# Altium project Rover_Alim.PrjPcb
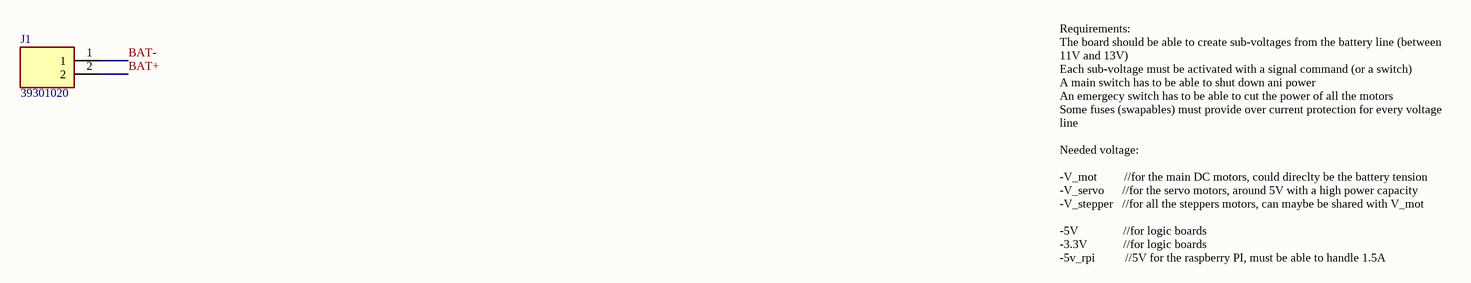
[diagram p0: Rover_Alim.SchDoc]
1 sheet, 1 parts. Net scope: global (net labels, ports and power ports of the same name join across sheets).

## Sheet Rover_Alim.SchDoc
size A4

### Parts
J1  39301020  [39301020]

### Nets
BAT+: J1.2
BAT-: J1.1

### Notes on the sheet
- Requirements:
  The board should be able to create sub-voltages from the battery line (between 11V and 13V)
  Each sub-voltage must be activated with a signal command (or a switch)
  A main switch has to be able to shut down ani power
  An emergecy switch has to be able to cut the power of all the motors
  Some fuses (swapables) must provide over current protection for every voltage line
  Needed voltage:
  -V_mot         //for the main DC motors, could direclty be the battery tension
  -V_servo      //for the servo motors, around 5V with a high power capacity
  -V_stepper   //for all the steppers motors, can maybe be shared with V_mot
  -5V               //for logic boards
  -3.3V            //for logic boards
  -5v_rpi          //5V for the raspberry PI, must be able to handle 1.5A

### Library data of the parts
J1 = 39301020: Mini-Fit Jr - 2; Manufacturer_Name: Molex; Datasheet Link: https://www.molex.com/pdm_docs/sd/039301020_sd.pdf; Height: 9.6mm; Manufacturer_Part_Number: 39301020